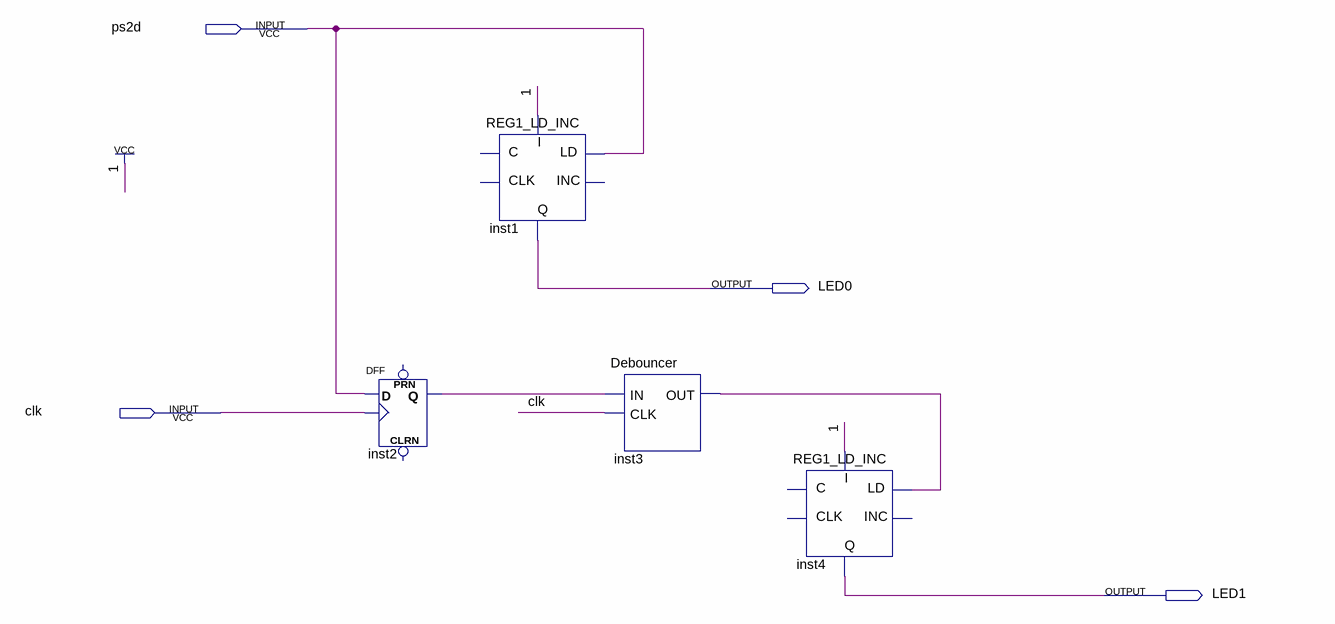
[diagram p0: schematic sheet]
// Quartus schematic PS2_Mouse_Init.bdf as structural Verilog: 4 symbols, 4 pins
module PS2_Mouse_Init (
  input  ps2d,
  input  clk,
  output LED0,
  output LED1
);

  wire inst2_q, inst3_out;

  DFF inst2 (.CLK(clk), .D(ps2d), .Q(inst2_q));  // open: CLRN, PRN
  REG1_LD_INC inst1 (.I(1'b1), .LD(ps2d), .Q(LED0));  // open: INC, CLK, C
  Debouncer inst3 (.IN(inst2_q), .CLK(clk), .OUT(inst3_out));
  REG1_LD_INC inst4 (.I(1'b1), .LD(inst3_out), .Q(LED1));  // open: INC, CLK, C
endmodule
